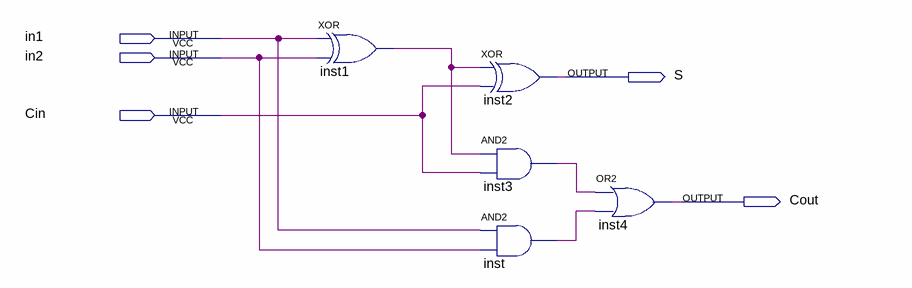
[diagram p0: schematic sheet]
// Quartus schematic FullAdder.bdf as structural Verilog: 5 symbols, 5 pins
module FullAdder (
  input  in1,
  input  in2,
  input  Cin,
  output S,
  output Cout
);

  wire inst1_out, inst3_out, inst_out;

  xor inst1 (inst1_out, in1, in2);
  xor inst2 (S, inst1_out, Cin);
  and inst3 (inst3_out, inst1_out, Cin);
  and inst (inst_out, in1, in2);
  or inst4 (Cout, inst3_out, inst_out);
endmodule
